# Altium schematic sheet CHARGHER_SHUTDOWN.SchDoc
size A3; SheetNumber: 2; SheetTotal: 2
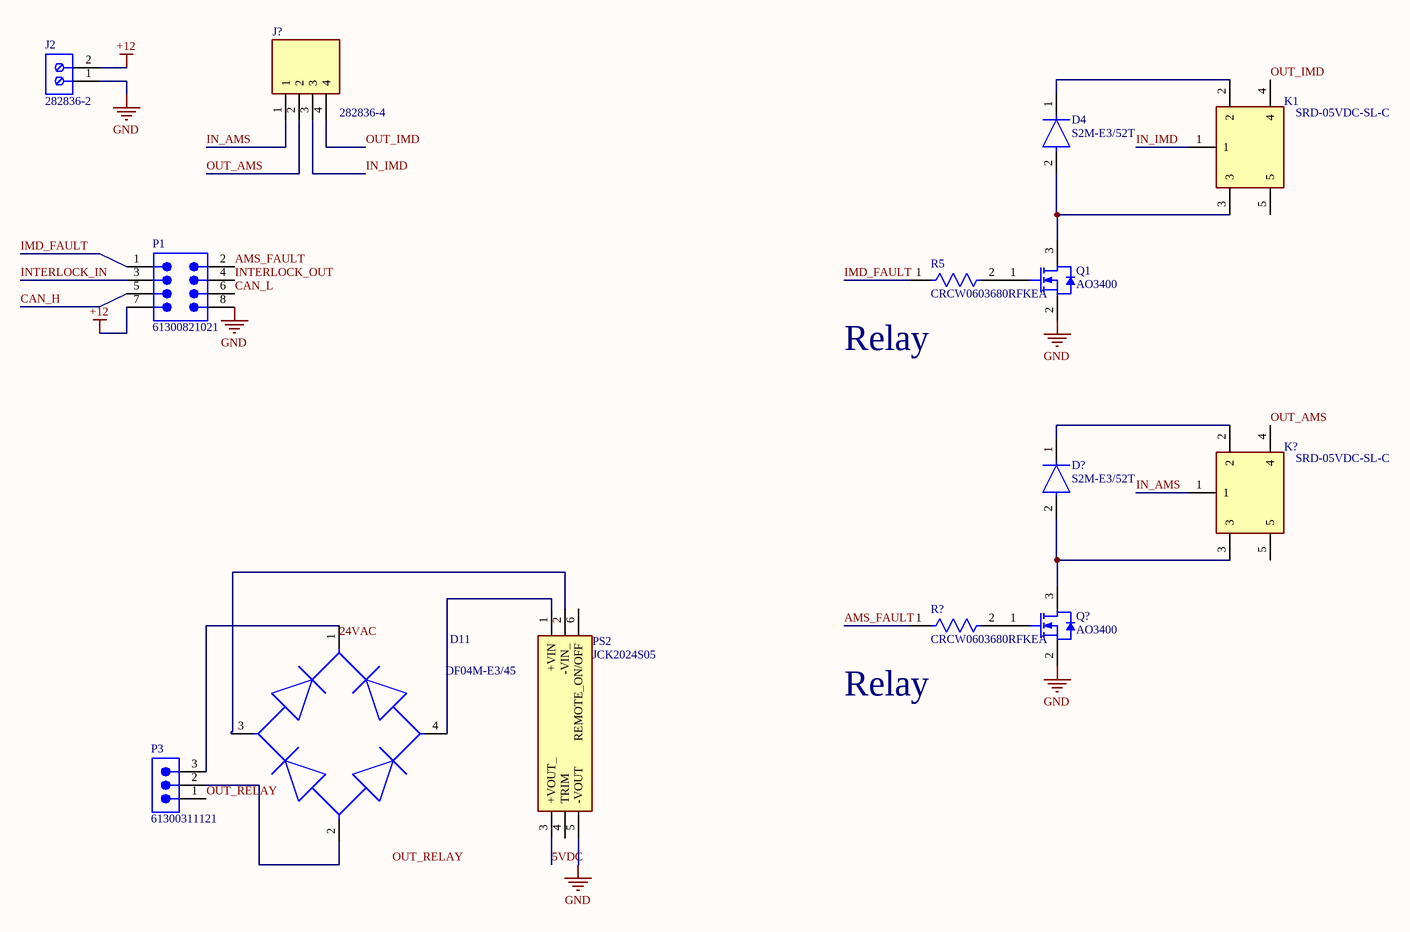
[diagram p0: CHARGHER_SHUTDOWN.SchDoc]

## Parts
D4  S2M-E3/52T  [FP-95401-MFG]
D11  DF04M-E3/45  [FP-DF04M-E3-45-0]
D?  S2M-E3/52T  [FP-95401-MFG]
J2  282836-2  [TECO-282836-2_V]
J?  282836-4  [2828364]
K1  SRD-05VDC-SL-C  [SRD]
K?  SRD-05VDC-SL-C  [SRD]
P1  61300821021  [61300821021]
P3  61300311121  [61300311121]
PS2  JCK2024S05  [JCK2024S05]
Q1  AO3400  [AO-SOT23-3_V]
Q?  AO3400  [AO-SOT23-3_V]
R5  CRCW0603680RFKEA  [FP-CRCW0603-e3-MFG]
R?  CRCW0603680RFKEA  [FP-CRCW0603-e3-MFG]

## Nets
+12: J2.2 P1.7
GND: J2.1 P1.8 PS2.5(-VOUT) Q1.2(S) Q?.2(S)
5VDC: PS2.3(+VOUT_)
AMS_FAULT: P1.2 R?.1
CAN_H: P1.5
CAN_L: P1.6
IMD_FAULT: P1.1 R5.1
IN_AMS: J?.1 K?.1
IN_IMD: J?.3 K1.1
INTERLOCK_IN: P1.3
INTERLOCK_OUT: P1.4
OUT_AMS: J?.2 K?.4
OUT_IMD: J?.4 K1.4
OUT_RELAY: P3.1
NetD4_1: D4.1(C) K1.2
NetD4_2: D4.2(A) K1.3 Q1.3(D)
NetD11_1: D11.1(+) P3.3
NetD11_2: D11.2(-) P3.2
NetD11_3: D11.3(1_~) PS2.2(-VIN_)
NetD11_4: D11.4(2_~) PS2.1(+VIN)
NetD?_1: D?.1(C) K?.2
NetD?_2: D?.2(A) K?.3 Q?.3(D)
NetQ1_1: Q1.1(G) R5.2
NetQ?_1: Q?.1(G) R?.2

Not connected (* = marked no-connect by the designer): K1 5; K? 5; PS2 4(TRIM) 6(REMOTE_ON/OFF)

## Notes on the sheet
- (near R5) Relay
- (near R?) Relay
- Labels drawn without touching a wire or pin: 24VAC, OUT_RELAY

## Library data of the parts
D4 D? = CMP-02540-000081-1: DIODE GEN PURP 1KV 1.5A DO214AA; Max Reverse Current: 1uA; Polarity: Standard; Recovery Time: 2000ns; Element Configuration: Single; Max Forward Surge Current (Ifsm): 50A; Forward Voltage: 1.15V; Capacitance: 16pF; Reverse Recovery Time: 2us; Max Reverse Voltage (DC): 1kV; Series: -; Lead Free: Lead Free; Forward Current: 1.5A; Voltage Rating (DC): 1kV; Packaging: Tape and Reel; Average Rectified Current: 1.5A; Max Repetitive Reverse Voltage (Vrrm): 1kV; Max Operating Temperature: 150°C; Length: 4.57mm; Current Rating: 1.5A; Mount: Surface Mount; Radiation Hardening: No; Peak Non-Repetitive Surge Current: 50A; Case/Package: SMB; Output Current: 1.5A; Reverse Voltage: 1kV; Min Operating Temperature: -55°C; Height: 2.24mm; Width: 3.94mm; Package Quantity: 750; RoHS Compliant: Yes; Max Surge Current: 50A; Number of Pins: 2
D11 = CMP-00030-42173530-1: DF04M-E3/45 Rectifier Bridge Diode Single 400V 1A 4-Pin Case DFM Tube / BRIDGE RECT 1PHASE 400V 1A DFM; Peak Non-Repetitive Surge Current: 50A; Forward Voltage: 1.1V; Max Reverse Leakage Current: 5µA; Max Junction Temperature (Tj): 150°C; Number of Elements: 1; Capacitance: 25pF; NexarPartId: 42173530; Radiation Hardening: No; REACH SVHC: Unknown; Height: 3.3mm; Max Operating Temperature: 150°C; Element Configuration: Single; Width: 6.5mm; Length: 8.51mm; Min Operating Temperature: -55°C; Mount: Through Hole; Number of Pins: 4; Max Repetitive Reverse Voltage (Vrrm): 400V; Schedule B: 8541100080, 8541100080; Case/Package: DIP; RoHS: Compliant; Max Forward Surge Current (Ifsm): 50A; Max Surge Current: 50A; Forward Current: 1A; Average Rectified Current: 1A; Peak Reverse Current: 5µA; Reverse Voltage: 400V; Current Rating: 1A; Breakdown Voltage: 400V; Lead Free: Lead Free
J2 = CMP-1684-00017-1: Female Header, Pitch 5 mm, 1 x 2 Position, Height 10 mm, Tail Length 3.5 mm, Rohs, Bulk; Manufacturer: TE Connectivity; Wire Gauge: 16-30AWG; Product Training Modules: Wire-to-BoardEurostyleTerminalBlocks; Clamp Material - Plating: Brass-NickelPlated; Voltage: 300V; Mating Orientation: HorizontalwithBoard; Current: 13.5A; Pitch: 0.197"(5.00mm); Screw Thread: M3; 3D Model: 282836-2.pdf; Other Names: 5ULV-02B / A98076; Dynamic Catalog: BuchananSeries; Number of Levels: 1; Torque - Screw: 0.68Nm(6Lb-In); Featured Product: EurostyleTerminalBlockConnectors; Positions Per Level: 2; Wire Termination: Screw-RisingCageClamp; Datasheet URL: http://www.te.com.cn/commerce/DocumentDelivery/DDEController?Action=showdoc&DocId=Catalog+Section%7F1308389_EUROSTYLE_TERMINAL_BLOCKS%7F0607%7Fpdf%7FEnglish%7FENG_CS_1308389_EUROSTYLE_TERMINAL_BLOCKS_0607.pdf%7F282836-2; Color: Green; Family: TerminalBlocks-WiretoBoard; RoHS Information: 282836-2StatementofCompliance; Standard Package: 300; Contact Material - Plating: Brass-TinPlated; Manufacturer URL: http://www.te.com; Housing Material: Polyamide(PA66),Nylon6/6; Features: Interlocking(Side); Package Description: Female Header, Pitch 5 mm, 1 x 2 Position, Height 10 mm, Tail Length 3.5 mm; Mounting Type: ThroughHole; Package Reference: THD; Packaging: Bulk; Series: Buchanan; Category: Connectors,Interconnects; Screw Material - Plating: Brass-NickelPlated
J? = 282836-4: Connector; Manufacturer_Name: TE Connectivity; Datasheet Link: https://www.te.com/commerce/DocumentDelivery/DDEController?Action=showdoc&DocId=Customer+Drawing%7F282836%7FJ%7Fpdf%7FEnglish%7FENG_CD_282836_J.pdf%7F282836-4; Height: 10.2mm; Manufacturer_Part_Number: 282836-4; Mouser Part Number: 571-2828364; Mouser Price/Stock: https://www.mouser.co.uk/ProductDetail/TE-Connectivity/282836-4?qs=A%252Bip%252BNCYi6ObENxJffNuog%3D%3D; Arrow Part Number: 282836-4; Arrow Price/Stock: https://www.arrow.com/en/products/282836-4/te-connectivity?region=europe
K1 K? = SRD-05VDC-SL-C: Relay or Contactor; Manufacturer_Name: Songle Relay; Datasheet Link: http://files.microjpm.webnode.com/200001010-dda41de9e1/Songle%20Relay%20Datasheet.pdf; Manufacturer_Part_Number: SRD-05VDC-SL-C
P1 = CMP-1502-01077-2: NexarPartId: 24514101; Number of Contacts: 8; Gender: Male; Row Spacing: 2.54mm; Connector Type: Male Pin; Current Rating: 3A; Contact Resistance: 20mΩ; Operating Supply Voltage: 250V; Contact Mating Length: 5.9944mm; Packaging: Bulk; Number of Positions: 8; Number of Pins: 8; Contact Material: Copper; Color: Black; REACH SVHC: Unknown; Lead Pitch: 2.54mm; RoHS: Compliant; Contact Plating: Gold; Pitch: 2.54mm; Number of Rows: 2; Mount: Through Hole; Termination: Solder
P3 = CMP-1502-01062-2: NexarPartId: 32855521; Voltage Rating: 250V; Current Rating: 3A; Connector Type: Male Pin; Number of Positions: 3; Gender: Male; Contact Resistance: 20mΩ; Pitch: 2.54mm; Max Operating Temperature: 105°C; Lead Pitch: 2.54mm; Lead Free: Lead Free; Contact Mating Length: 5.9944mm; Contact Material: Copper; Number of Pins: 3; Orientation: Vertical; Height: 8.94mm; Packaging: Bulk; Min Operating Temperature: -40°C; Mount: Through Hole; RoHS: Compliant; Number of Contacts: 3; Operating Supply Voltage: 250V; Termination: Solder; Number of Rows: 1; Contact Plating: Gold; Color: Black; REACH SVHC: Unknown
PS2 = JCK2024S05: Power Supply; Manufacturer_Name: XP POWER; Datasheet Link: https://www.xppower.com/portals/0/pdfs/SF_JCK20.pdf; Height: 11.2mm; Manufacturer_Part_Number: JCK2024S05; Mouser Part Number: 209-JCK2024S05; Mouser Price/Stock: https://www.mouser.com/Search/Refine.aspx?Keyword=209-JCK2024S05
Q1 Q? = CMP-0278-00001-1: N-channel Enhancement Mode Field-Effect Transistor; 5.8A/30V; Manufacturer: Alpha and Omega; Channel Type: N; Drain-Source Voltage Limit: 30 V; Junction Temperature: -55 to 150 degC; Gate-Source Voltage Limit: +/-12 V; PackageDescription: 3-Pin SOT23, 3.016 x 2.8 mm Body, 0.95 mm Pitch; ComponentLink2Description: Datasheet; DatasheetVersion: Rev.8, 12/2011; ComponentLink3URL: http://www.aosmd.com/res/packaging_information/SOT-23.pdf; Storage Temperature: -55 to 150 degC; ComponentLink3Description: Package Specification; PackageReference: SOT23; ComponentLink1Description: Manufacturer URL; Mounting Technology: Surface Mount; ComponentLink1URL: http://www.aosmd.com/; PartNumber: AO3400; ComponentLink2URL: http://www.aosmd.com/res/data_sheets/AO3400.pdf
R5 R? = CMP-2000-03529-2: RES Thick Film, 680Ω, 1%, 0.1W, 100ppm/°C, 0603; Voltage Rating (DC): 75V; Max Power Dissipation: 100mW; Resistance: 680R; Radiation Hardening: No; Case Code (Imperial): 0603; Number of Pins: 2; Termination: SMD/SMT; Lead Free: Lead Free; Contact Plating: Tin; Case Code (Metric): 1608; Max Operating Temperature: 155°C; Tolerance: 1%; Military Standard: Not; Features: Automotive AEC-Q200; Power Rating: 100mW; Width: 0.85mm; Depth: 0.85mm; Height: 0.45mm; Case/Package: 0603; Min Operating Temperature: -55°C; Length: 1.55mm; Voltage Rating: 75V; Composition: Thick Film; Working Voltage: 75V; Temperature Coefficient: 100ppm/°C; Packaging: Tape and Reel; Package Quantity: 10; Weight: 7.1E-05oz; Number of Terminations: 2